# Altium project dashcam_bb_v2.0.PrjPcb (part 1 of 8)
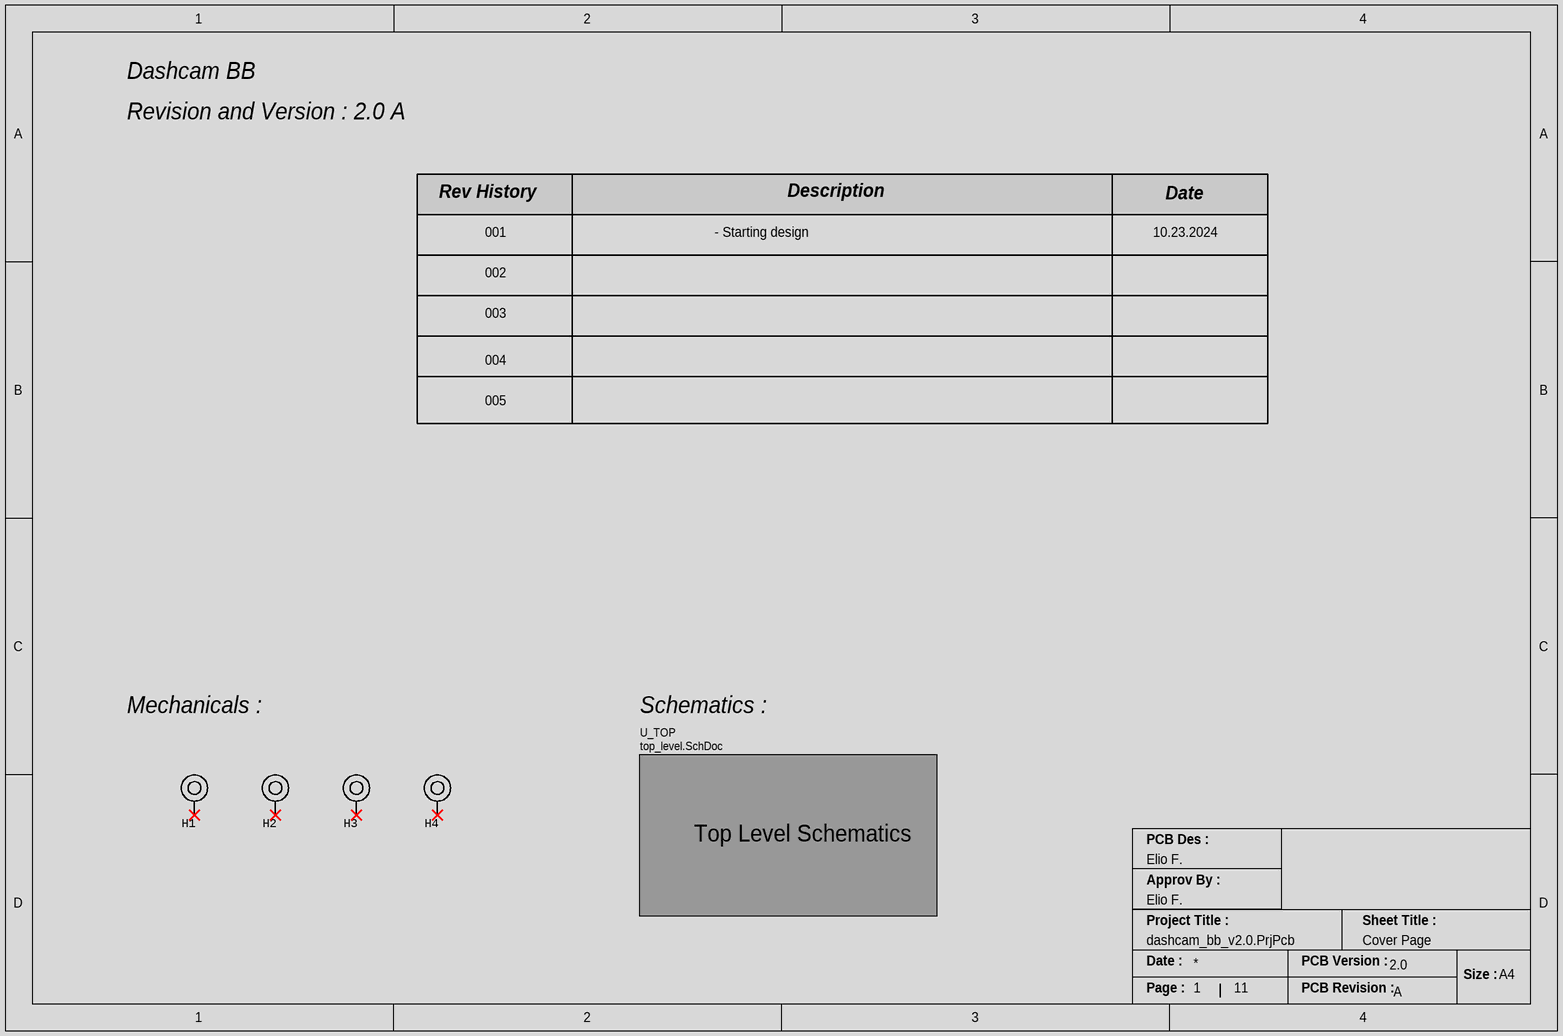
[diagram p0: cover_page.SchDoc]
Letter: A; ProjectTitle: Dashcam BB V2.0 A; Version: 2.0
11 sheets, 284 parts. Net scope: flat (ports and power ports of the same name join across sheets).
Board file: Dashcam BB V2.0 A.PcbDoc
Sheets:
  cover_page.SchDoc
    U_TOP = top_level.SchDoc
      U_CONNB = connector_b.SchDoc
      U_CONNA = connector_a.SchDoc
      U_GNSS_GPS = gnss_gps.SchDoc
      U_IMU = imu.SchDoc
      U_MIPI_SER1 = mipi_serializer1.SchDoc
      U_CAM_CONN = camera_connector.SchDoc
      U_MIPI_SER2 = mipi_serializer2.SchDoc
      U_MIPI_DES = mipi_deserializer.SchDoc
      U_MIPI_DES_POC = mipi_deserializer_poc.SchDoc

## Sheet cover_page.SchDoc
size A4; Email: eliofagundez07@gmail.com; DrawnBy: Elio F.; Engineer: Elio F.; Revision: A; SheetNumber: 1; SheetTotal: 11; Sheet Title: Cover Page

### Parts
H1  Mounting Hole  [PTH_3.2X5]  (value not drawn)  (no BOM)
H2  Mounting Hole  [PTH_3.2X5]  (value not drawn)  (no BOM)
H3  Mounting Hole  [PTH_3.2X5]  (value not drawn)  (no BOM)
H4  Mounting Hole  [PTH_3.2X5]  (value not drawn)  (no BOM)

### Sub-sheets
U_TOP = top_level.SchDoc: no entries

### Nets

Not connected (* = marked no-connect by the designer): H1 1*; H2 1*; H3 1*; H4 1*

### Notes on the sheet
- Dashcam BB
- Revision and Version : 2.0 A
- Rev History
- 001
- - Starting design
- Description
- 10.23.2024
- Date
- 002
- 003
- 004
- 005
- Mechanicals :
- Schematics :
- Top Level Schematics
- PCB Des :
- Approv By :
- Project Title :
- Sheet Title :
- Date :
- PCB Version :
- Size :
- A4
- Page :
- PCB Revision :

### Library data of the parts
H1-H4 = MECHANICALS_MOUNT_PTH: Mounting Hole, Plated

## Sheet top_level.SchDoc: top level
size A3; DrawnBy: Elio F; Engineer: Elio F; Revision: 1.0; SheetNumber: 2; SheetTotal: 11; Sheet Title: Top Level
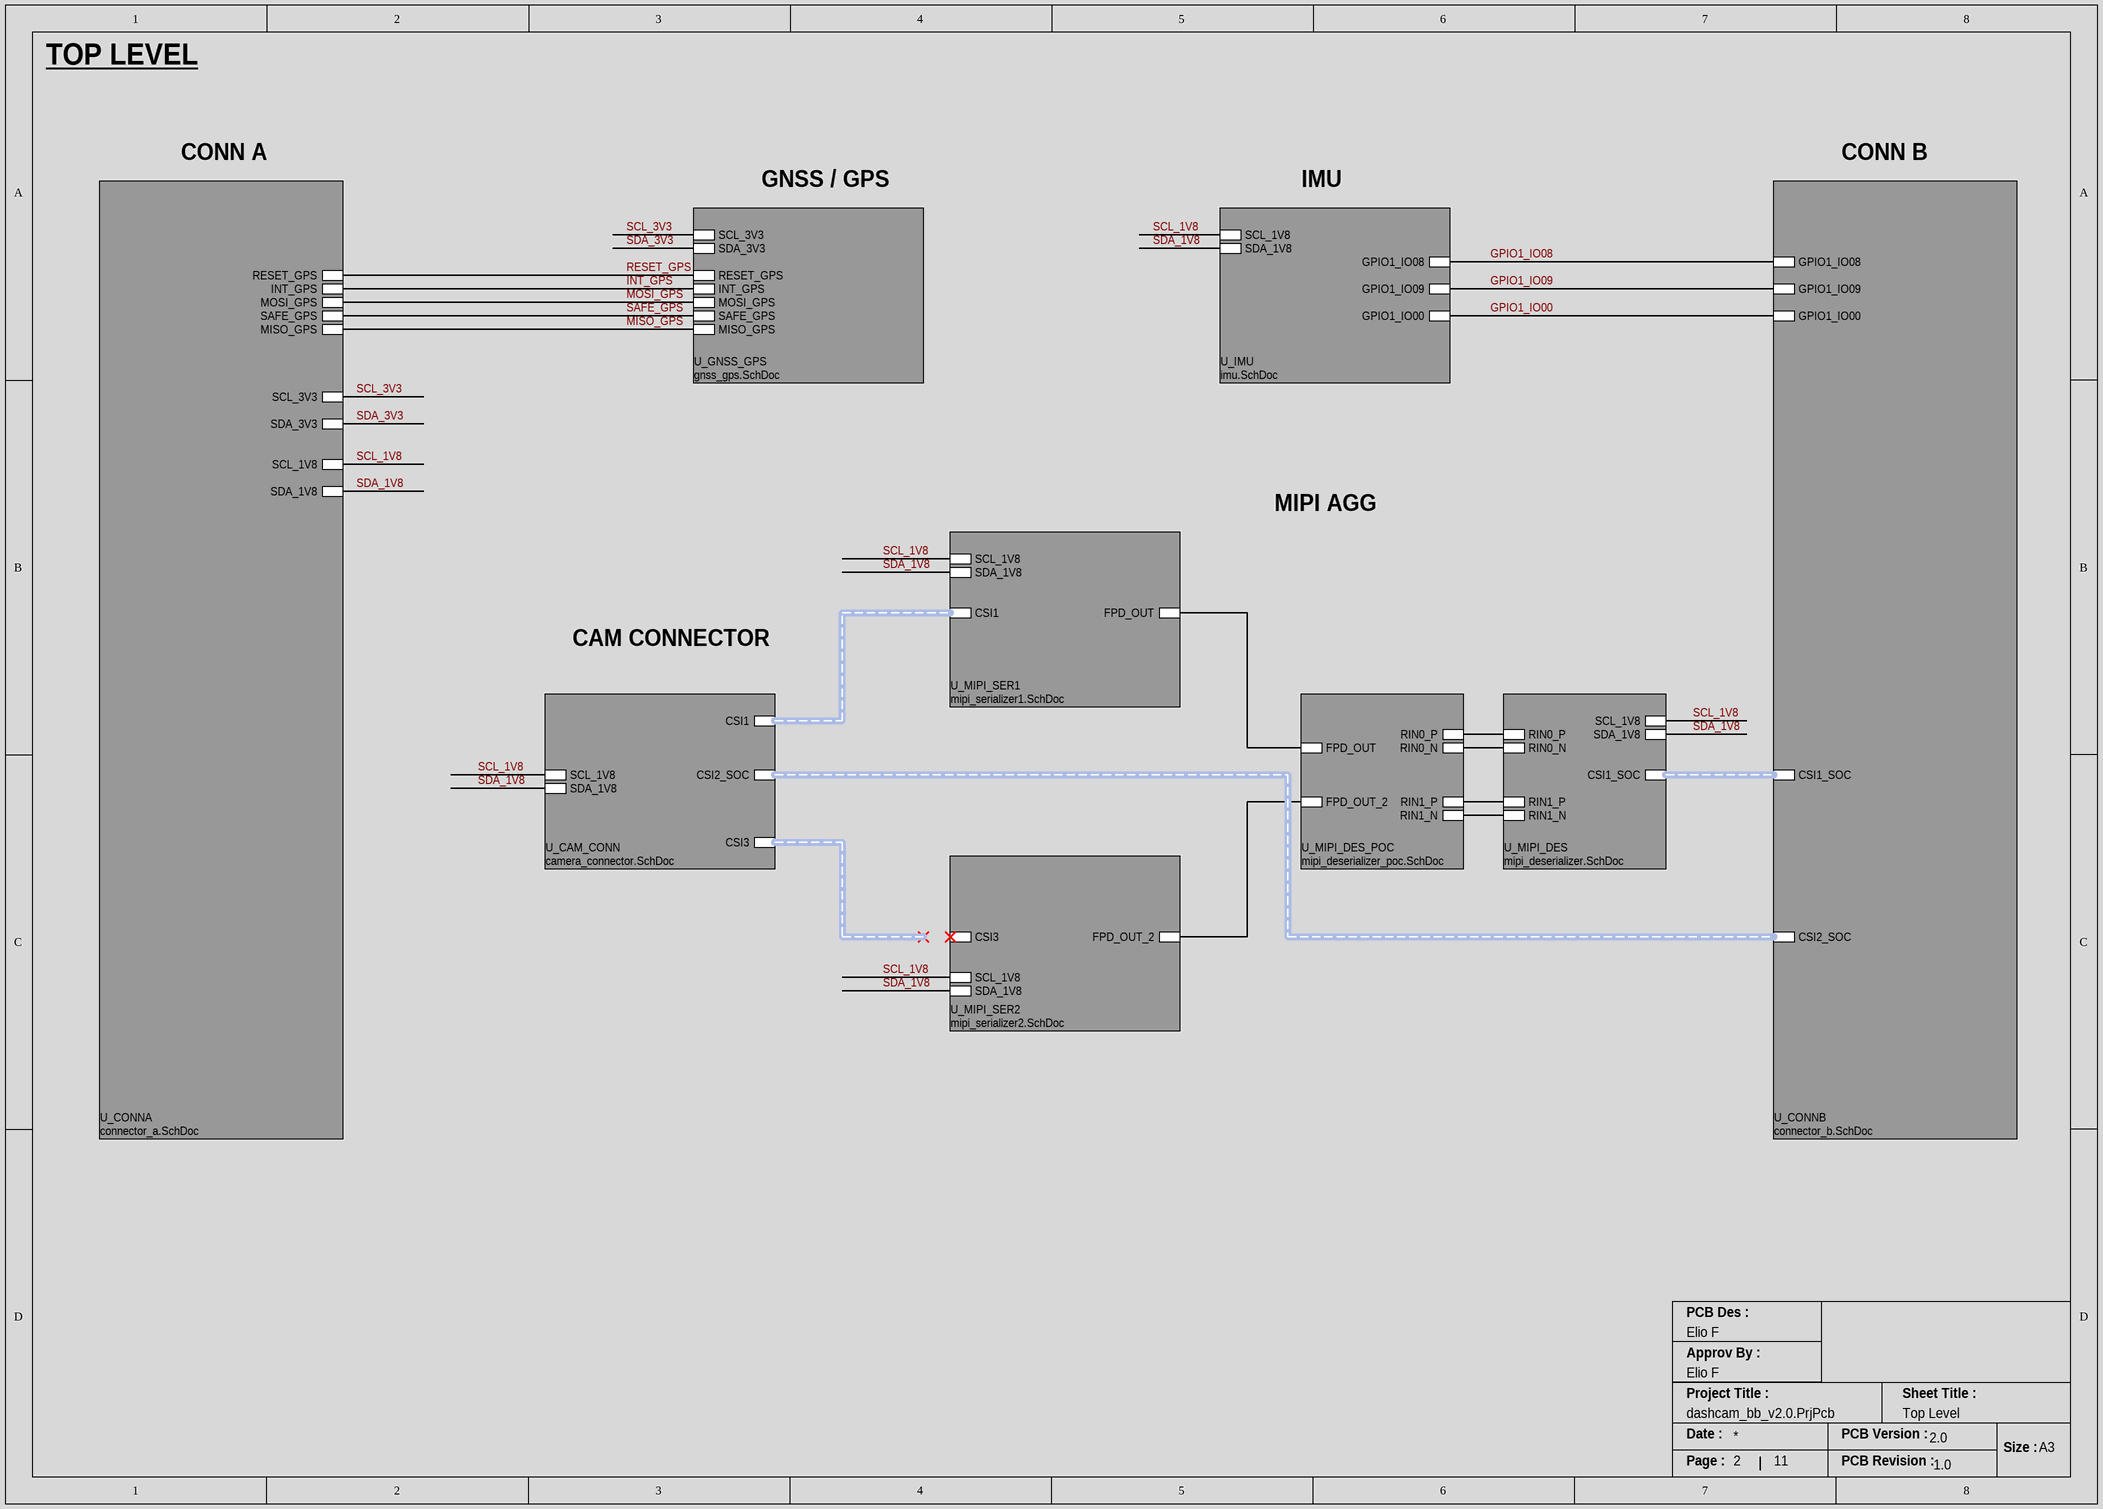
[diagram p1: top_level.SchDoc]

### Sub-sheets
U_CAM_CONN = camera_connector.SchDoc: CSI1 (harness CSI1), CSI3 (harness CSI3), CSI2_SOC (harness CSI2_SOC), SCL_1V8, SDA_1V8
U_CONNA = connector_a.SchDoc: SCL_3V3, SDA_3V3, RESET_GPS, INT_GPS, MOSI_GPS, SAFE_GPS, MISO_GPS, SCL_1V8, SDA_1V8
U_CONNB = connector_b.SchDoc: CSI2_SOC (harness CSI2_SOC), CSI1_SOC (harness CSI1_SOC), GPIO1_IO08, GPIO1_IO09, GPIO1_IO00
U_GNSS_GPS = gnss_gps.SchDoc: RESET_GPS, INT_GPS, MISO_GPS, MOSI_GPS, SAFE_GPS, SCL_3V3, SDA_3V3
U_IMU = imu.SchDoc: GPIO1_IO08, GPIO1_IO09, GPIO1_IO00, SCL_1V8, SDA_1V8
U_MIPI_DES = mipi_deserializer.SchDoc: RIN0_P, RIN0_N, RIN1_P, RIN1_N, CSI1_SOC (harness CSI1_SOC), SCL_1V8, SDA_1V8
U_MIPI_DES_POC = mipi_deserializer_poc.SchDoc: FPD_OUT, FPD_OUT_2, RIN0_P, RIN0_N, RIN1_P, RIN1_N
U_MIPI_SER1 = mipi_serializer1.SchDoc: CSI1 (harness CSI1), FPD_OUT, SCL_1V8, SDA_1V8
U_MIPI_SER2 = mipi_serializer2.SchDoc: CSI3 (harness CSI3), FPD_OUT_2, SCL_1V8, SDA_1V8

### Nets
GPIO1_IO00: sheet U_CONNB/GPIO1_IO00, sheet U_IMU/GPIO1_IO00
GPIO1_IO08: sheet U_CONNB/GPIO1_IO08, sheet U_IMU/GPIO1_IO08
GPIO1_IO09: sheet U_CONNB/GPIO1_IO09, sheet U_IMU/GPIO1_IO09
INT_GPS: sheet U_CONNA/INT_GPS, sheet U_GNSS_GPS/INT_GPS
MISO_GPS: sheet U_CONNA/MISO_GPS, sheet U_GNSS_GPS/MISO_GPS
MOSI_GPS: sheet U_CONNA/MOSI_GPS, sheet U_GNSS_GPS/MOSI_GPS
RESET_GPS: sheet U_CONNA/RESET_GPS, sheet U_GNSS_GPS/RESET_GPS
SAFE_GPS: sheet U_CONNA/SAFE_GPS, sheet U_GNSS_GPS/SAFE_GPS
SCL_1V8: sheet U_CONNA/SCL_1V8, sheet U_IMU/SCL_1V8, sheet U_MIPI_SER1/SCL_1V8, sheet U_CAM_CONN/SCL_1V8, sheet U_MIPI_SER2/SCL_1V8, sheet U_MIPI_DES/SCL_1V8
SCL_3V3: sheet U_CONNA/SCL_3V3, sheet U_GNSS_GPS/SCL_3V3
SDA_1V8: sheet U_CONNA/SDA_1V8, sheet U_IMU/SDA_1V8, sheet U_MIPI_SER1/SDA_1V8, sheet U_CAM_CONN/SDA_1V8, sheet U_MIPI_SER2/SDA_1V8, sheet U_MIPI_DES/SDA_1V8
SDA_3V3: sheet U_CONNA/SDA_3V3, sheet U_GNSS_GPS/SDA_3V3
(unnamed): sheet U_MIPI_SER1/FPD_OUT, sheet U_MIPI_DES_POC/FPD_OUT
(unnamed): sheet U_MIPI_SER2/FPD_OUT_2, sheet U_MIPI_DES_POC/FPD_OUT_2
(unnamed): sheet U_MIPI_DES/RIN0_P, sheet U_MIPI_DES_POC/RIN0_P
(unnamed): sheet U_MIPI_DES/RIN0_N, sheet U_MIPI_DES_POC/RIN0_N
(unnamed): sheet U_MIPI_DES/RIN1_P, sheet U_MIPI_DES_POC/RIN1_P
(unnamed): sheet U_MIPI_DES/RIN1_N, sheet U_MIPI_DES_POC/RIN1_N

### Buses and harness runs
harness sheet U_CAM_CONN/CSI1 = sheet U_MIPI_SER1/CSI1
harness sheet U_CAM_CONN/CSI2_SOC = sheet U_CONNB/CSI2_SOC
harness sheet U_CONNB/CSI1_SOC = sheet U_MIPI_DES/CSI1_SOC

### Notes on the sheet
- TOP LEVEL
- CONN A
- CONN B
- GNSS / GPS
- IMU
- MIPI AGG
- CAM CONNECTOR
- PCB Des :
- Approv By :
- Project Title :
- Sheet Title :
- Date :
- PCB Version :
- Size :
- A3
- Page :
- PCB Revision :

## Sheet connector_b.SchDoc
size A3; DrawnBy: Elio F; Engineer: Elio F; Revision: A; SheetNumber: 4; SheetTotal: 11; Sheet Title: Connector B
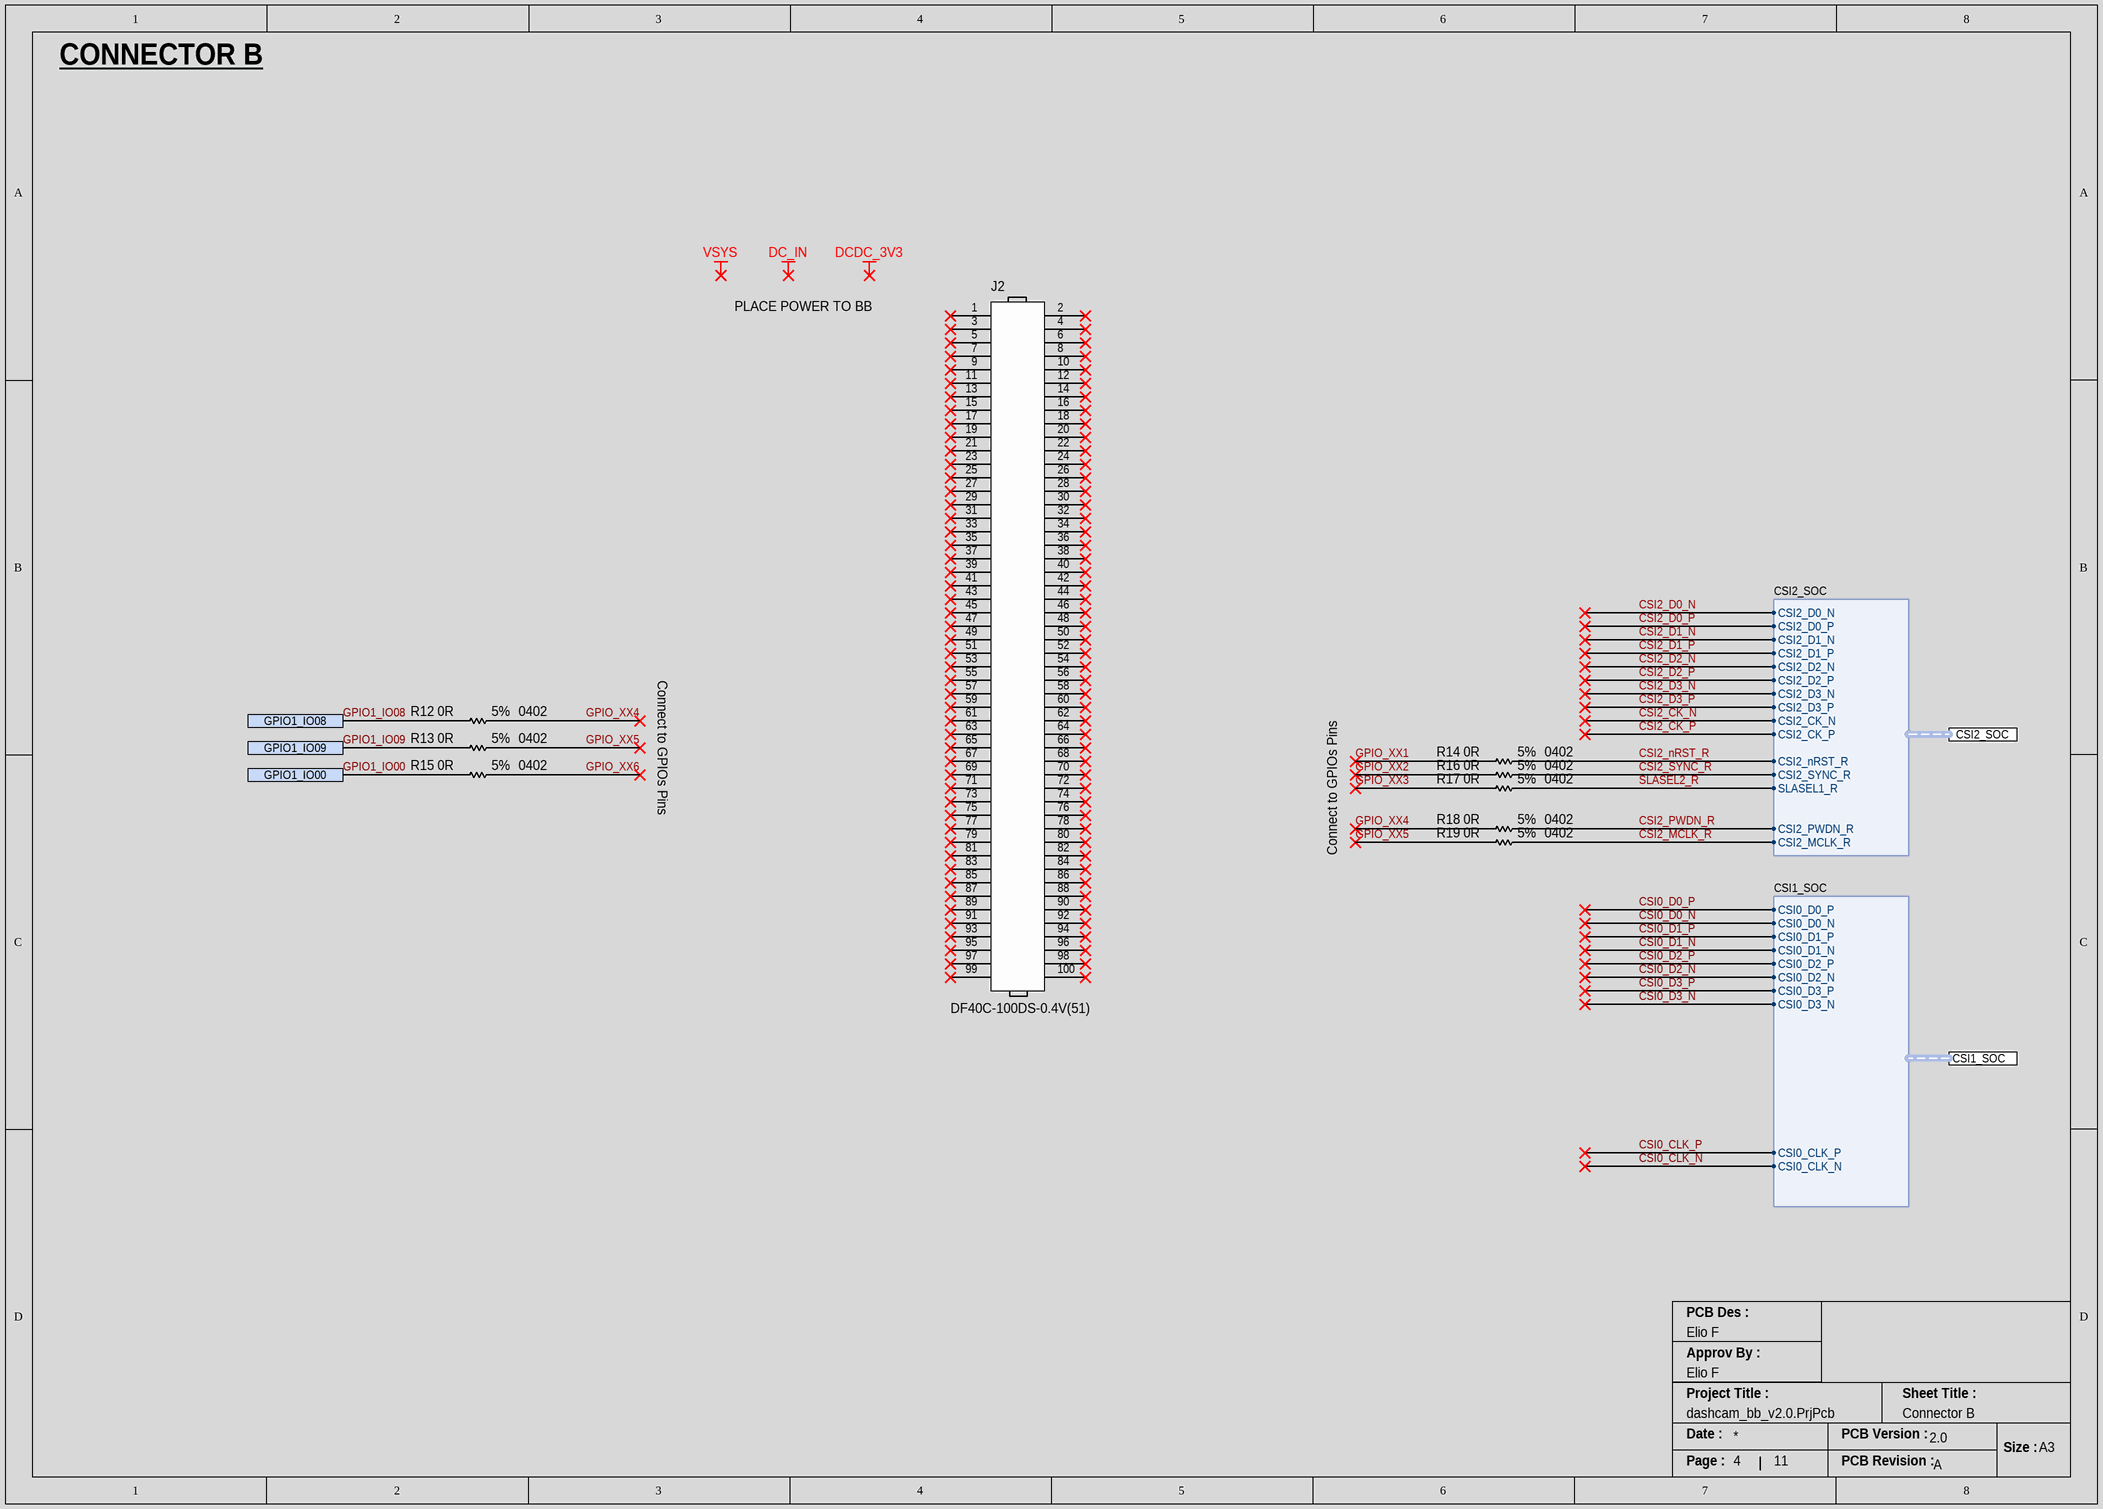
[diagram p2: connector_b.SchDoc]

### Parts
J2  DF40C-100DS-0.4V(51)  [CONN_B2B_HIROSE_DF40C-100DS-0.4V(51)]
R12  Case Code (Imperial): 0402  Tolerance: 5%  Resistance: 0R  [RES_0402_RESC1005X04N]  (hidden comment: ERJ-2GE0R00X)
R13  Case Code (Imperial): 0402  Tolerance: 5%  Resistance: 0R  [RES_0402_RESC1005X04N]  (hidden comment: ERJ-2GE0R00X)
R14  Case Code (Imperial): 0402  Tolerance: 5%  Resistance: 0R  [RES_0402_RESC1005X04N]  (hidden comment: ERJ-2GE0R00X)
R15  Case Code (Imperial): 0402  Tolerance: 5%  Resistance: 0R  [RES_0402_RESC1005X04N]  (hidden comment: ERJ-2GE0R00X)
R16  Case Code (Imperial): 0402  Tolerance: 5%  Resistance: 0R  [RES_0402_RESC1005X04N]  (hidden comment: ERJ-2GE0R00X)
R17  Case Code (Imperial): 0402  Tolerance: 5%  Resistance: 0R  [RES_0402_RESC1005X04N]  (hidden comment: ERJ-2GE0R00X)
R18  Case Code (Imperial): 0402  Tolerance: 5%  Resistance: 0R  [RES_0402_RESC1005X04N]  (hidden comment: ERJ-2GE0R00X)
R19  Case Code (Imperial): 0402  Tolerance: 5%  Resistance: 0R  [RES_0402_RESC1005X04N]  (hidden comment: ERJ-2GE0R00X)

### Ports
CSI1_SOC (harness CSI1_SOC), CSI2_SOC (harness CSI2_SOC), GPIO1_IO00, GPIO1_IO08, GPIO1_IO09

### Harnesses
CSI2_SOC: CSI2_D0_N, CSI2_D0_P, CSI2_D1_N, CSI2_D1_P, CSI2_D2_N, CSI2_D2_P, CSI2_D3_N, CSI2_D3_P, CSI2_CK_N, CSI2_CK_P, CSI2_nRST_R, CSI2_SYNC_R, SLASEL1_R, CSI2_PWDN_R, CSI2_MCLK_R
CSI1_SOC: CSI0_D0_P, CSI0_D0_N, CSI0_D1_P, CSI0_D1_N, CSI0_D2_P, CSI0_D2_N, CSI0_D3_P, CSI0_D3_N, CSI0_CLK_P, CSI0_CLK_N

### Nets
CSI2_MCLK_R: R19.2 ; port CSI2_SOC.CSI2_MCLK_R
CSI2_nRST_R: R14.2 ; port CSI2_SOC.CSI2_nRST_R
CSI2_PWDN_R: R18.2 ; port CSI2_SOC.CSI2_PWDN_R
CSI2_SYNC_R: R16.2 ; port CSI2_SOC.CSI2_SYNC_R
GPIO1_IO00: R15.1 ; port GPIO1_IO00
GPIO1_IO08: R12.1 ; port GPIO1_IO08
GPIO1_IO09: R13.1 ; port GPIO1_IO09
GPIO_XX1: R14.1
GPIO_XX2: R16.1
GPIO_XX3: R17.1
GPIO_XX4: R12.2 R18.1
GPIO_XX5: R13.2 R19.1
GPIO_XX6: R15.2
SLASEL2_R: R17.2 ; port CSI2_SOC.SLASEL1_R

Not connected (* = marked no-connect by the designer): J2 1* 2* 3* 4* 5* 6* 7* 8* 9* 10* 11* 12* 13* 14* 15* 16* 17* 18* 19* 20* 21* 22* 23* 24* 25* 26* 27* 28* 29* 30* 31* 32* 33* 34* 35* 36* 37* 38* 39* 40* 41* 42* 43* 44* 45* 46* 47* 48* 49* 50* 51* 52* 53* 54* 55* 56* 57* 58* 59* 60* 61* 62* 63* 64* 65* 66* 67* 68* 69* 70* 71* 72* 73* 74* 75* 76* 77* 78* 79* 80* 81* 82* 83* 84* 85* 86* 87* 88* 89* 90* 91* 92* 93* 94* 95* 96* 97* 98* 99* 100*

### Notes on the sheet
- CONNECTOR B
- PLACE POWER TO BB
- Connect to GPIOs Pins
- Labels drawn without touching a wire or pin: DC_IN, DCDC_3V3, VSYS
- PCB Des :
- Approv By :
- Project Title :
- Sheet Title :
- Date :
- PCB Version :
- Size :
- A3
- Page :
- PCB Revision :

### Library data of the parts
J2 = CONN_B2B_100P_RE_DF40C-100DS-0.4V(51): Board-to-Board Connector with 0.4-mm Pitch, 1.5 - 4.0-mm Height - DF40 Series (HIROSE ELECTRIC); Voltage Rating: 30V; Current Rating: 300mA; Connector Type: Receptacle; Number of Positions: 100; Contact Resistance: 90mR; Pitch: 0.4mm; Mated Stacking Heights: 1.5mm; Contact Pitch: 400um; Supplier 1: Digikey; Manufacturer: Hirose; Manufacturer Part Number: DF40C-100DS-0.4V(51); RoHS: Yes; Category: Headers and Wire Housings; Stock 1: 4275; Pricing 1: 1=1.91, 10=1.661, 25=1.5908, 50=1.5554, 100=1.4847, 250=1.34328, 500=1.23724, 1000=1.0605, 2500=0.9898 (USD); Mount: Surface Mount; Contact Material: Bronze; Contact Plating: Gold; Housing Material: Polymer; Housing Color: Black; Min Operating Temperature: -35°C; Max Operating Temperature: 85°C; Number of Rows: 2; Packaging: Tape and Reel; Package Quantity: 1; Termination: SMD/SMT; Number of Contacts: 100; Orientation: Straight; Series: DF40; Max Current Rating: 300mA; Max Voltage Rating (AC): 30V; Gender: Receptacle; Contact Voltage Rating (AC): 30V; Contact Voltage Rating (DC): 30V; Length: 22.6mm; Depth: 3.38mm; Radiation Hardening: No; Reach SVHC Compliant: No; Lead Free: Lead Free; RoHS Compliant: Yes; ComponentLink1URL: https://datasheet.ciiva.com/26948/getdatasheetpartid-441624-26948933.pdf?src-supplier=Verical; ComponentLink1Description: https://datasheet.ciiva.com/26948/getdatasheetpartid-441624-26948933.pdf?src-supplier=Verical; ComponentLink2URL: https://datasheet.ciiva.com/46408/1824826-46408894.pdf?src-supplier=Element14; ComponentLink2Description: https://datasheet.ciiva.com/46408/1824826-46408894.pdf?src-supplier=Element14; Supplier Part Number 1: H11615CT-ND
R12-R19 = RES_0R_5%_100mW_0402: SMD Chip Resistor, Jumper, 0 ohm, 100 mW, 0402 [1005 Metric], Thick Film, General Purpose; Manufacturer: Panasonic; Power Rating: 100mW; Voltage Rating: 50V; Temperature Coefficient: 600ppm/°C; Supplier 1: Mouser; Manufacturer Part Number: ERJ-2GE0R00X; RoHS: Yes; Category: Chip SMD Resistors; Stock 1: 10989354; Pricing 1: 1=0.1, 10=0.013, 50=0.013, 100=0.006, 1000=0.004, 2500=0.003, 10000=0.003 (USD); Mount: Surface Mount; Case/Package: 0402; Contact Plating: Tin; Case Code (Metric): 1005; Size Code: 0402; Min Operating Temperature: -55°C; Max Operating Temperature: 155°C; Resistor Type: Thick Film; Packaging: Cut Tape; Package Quantity: 10000; Number of Terminations: 2; Termination: SMD/SMT; Max Power Dissipation: 100mW; Voltage Rating (DC): 50V; Features: Automotive AEC-Q200; Series: ERJ; Construction: Rectangular; Technology: THICK FILM; Length: 1mm; Width: 0.5mm; Height: 0.35mm; Depth: 0.5mm; Ratings: AEC-Q200; Radiation Hardening: No; Reach SVHC Compliant: No; Military Standard: Not; Lead Free: Lead Free; RoHS Compliant: Yes; ComponentLink1URL: https://datasheet.ciiva.com/11821/0900766b80f806dd-11821176.pdf?src-supplier=Rs; ComponentLink1Description: https://datasheet.ciiva.com/11821/0900766b80f806dd-11821176.pdf?src-supplier=Rs; ComponentLink2URL: https://datasheet.ciiva.com/43460/1678796-43460347.pdf?src-supplier=Farnell; ComponentLink2Description: https://datasheet.ciiva.com/43460/1678796-43460347.pdf?src-supplier=Farnell; ComponentLink3URL: https://datasheet.ciiva.com/46389/1678796-46389518.pdf?src-supplier=Element14; ComponentLink3Description: https://datasheet.ciiva.com/46389/1678796-46389518.pdf?src-supplier=Element14; ComponentLink4URL: https://datasheet.ciiva.com/5959/1678796-5959692.pdf?src-supplier=Farnell; ComponentLink4Description: https://datasheet.ciiva.com/5959/1678796-5959692.pdf?src-supplier=Farnell; ComponentLink5URL: https://datasheet.ciiva.com/28695/1678796-28695758.pdf?src-supplier=Element14; ComponentLink5Description: https://datasheet.ciiva.com/28695/1678796-28695758.pdf?src-supplier=Element14; ComponentLink6URL: https://datasheet.ciiva.com/16783/70260739-16783734.pdf?src-supplier=Allied+Electronics; ComponentLink6Description: https://datasheet.ciiva.com/16783/70260739-16783734.pdf?src-supplier=Allied+Electronics; ComponentLink7URL: https://datasheet.ciiva.com/16778/70260739-16778335.pdf?src-supplier=Allied+Electronics; ComponentLink7Description: https://datasheet.ciiva.com/16778/70260739-16778335.pdf?src-supplier=Allied+Electronics; ComponentLink8URL: https://datasheet.ciiva.com/48531/aoa0000ce1-48531077.pdf?src-supplier=Avnet; ComponentLink8Description: https://datasheet.ciiva.com/48531/aoa0000ce1-48531077.pdf?src-supplier=Avnet; ComponentLink9URL: https://datasheet.ciiva.com/30097/4aoa0000ce1-30097116.pdf?src-supplier=Onlinecomponents.com; ComponentLink9Description: https://datasheet.ciiva.com/30097/4aoa0000ce1-30097116.pdf?src-supplier=Onlinecomponents.com; Supplier Part Number 1: 667-ERJ-2GE0R00X

## Sheet connector_a.SchDoc
size A3; DrawnBy: Elio F; Engineer: Elio F; Revision: A; SheetNumber: 3; SheetTotal: 11; Sheet Title: Connector A
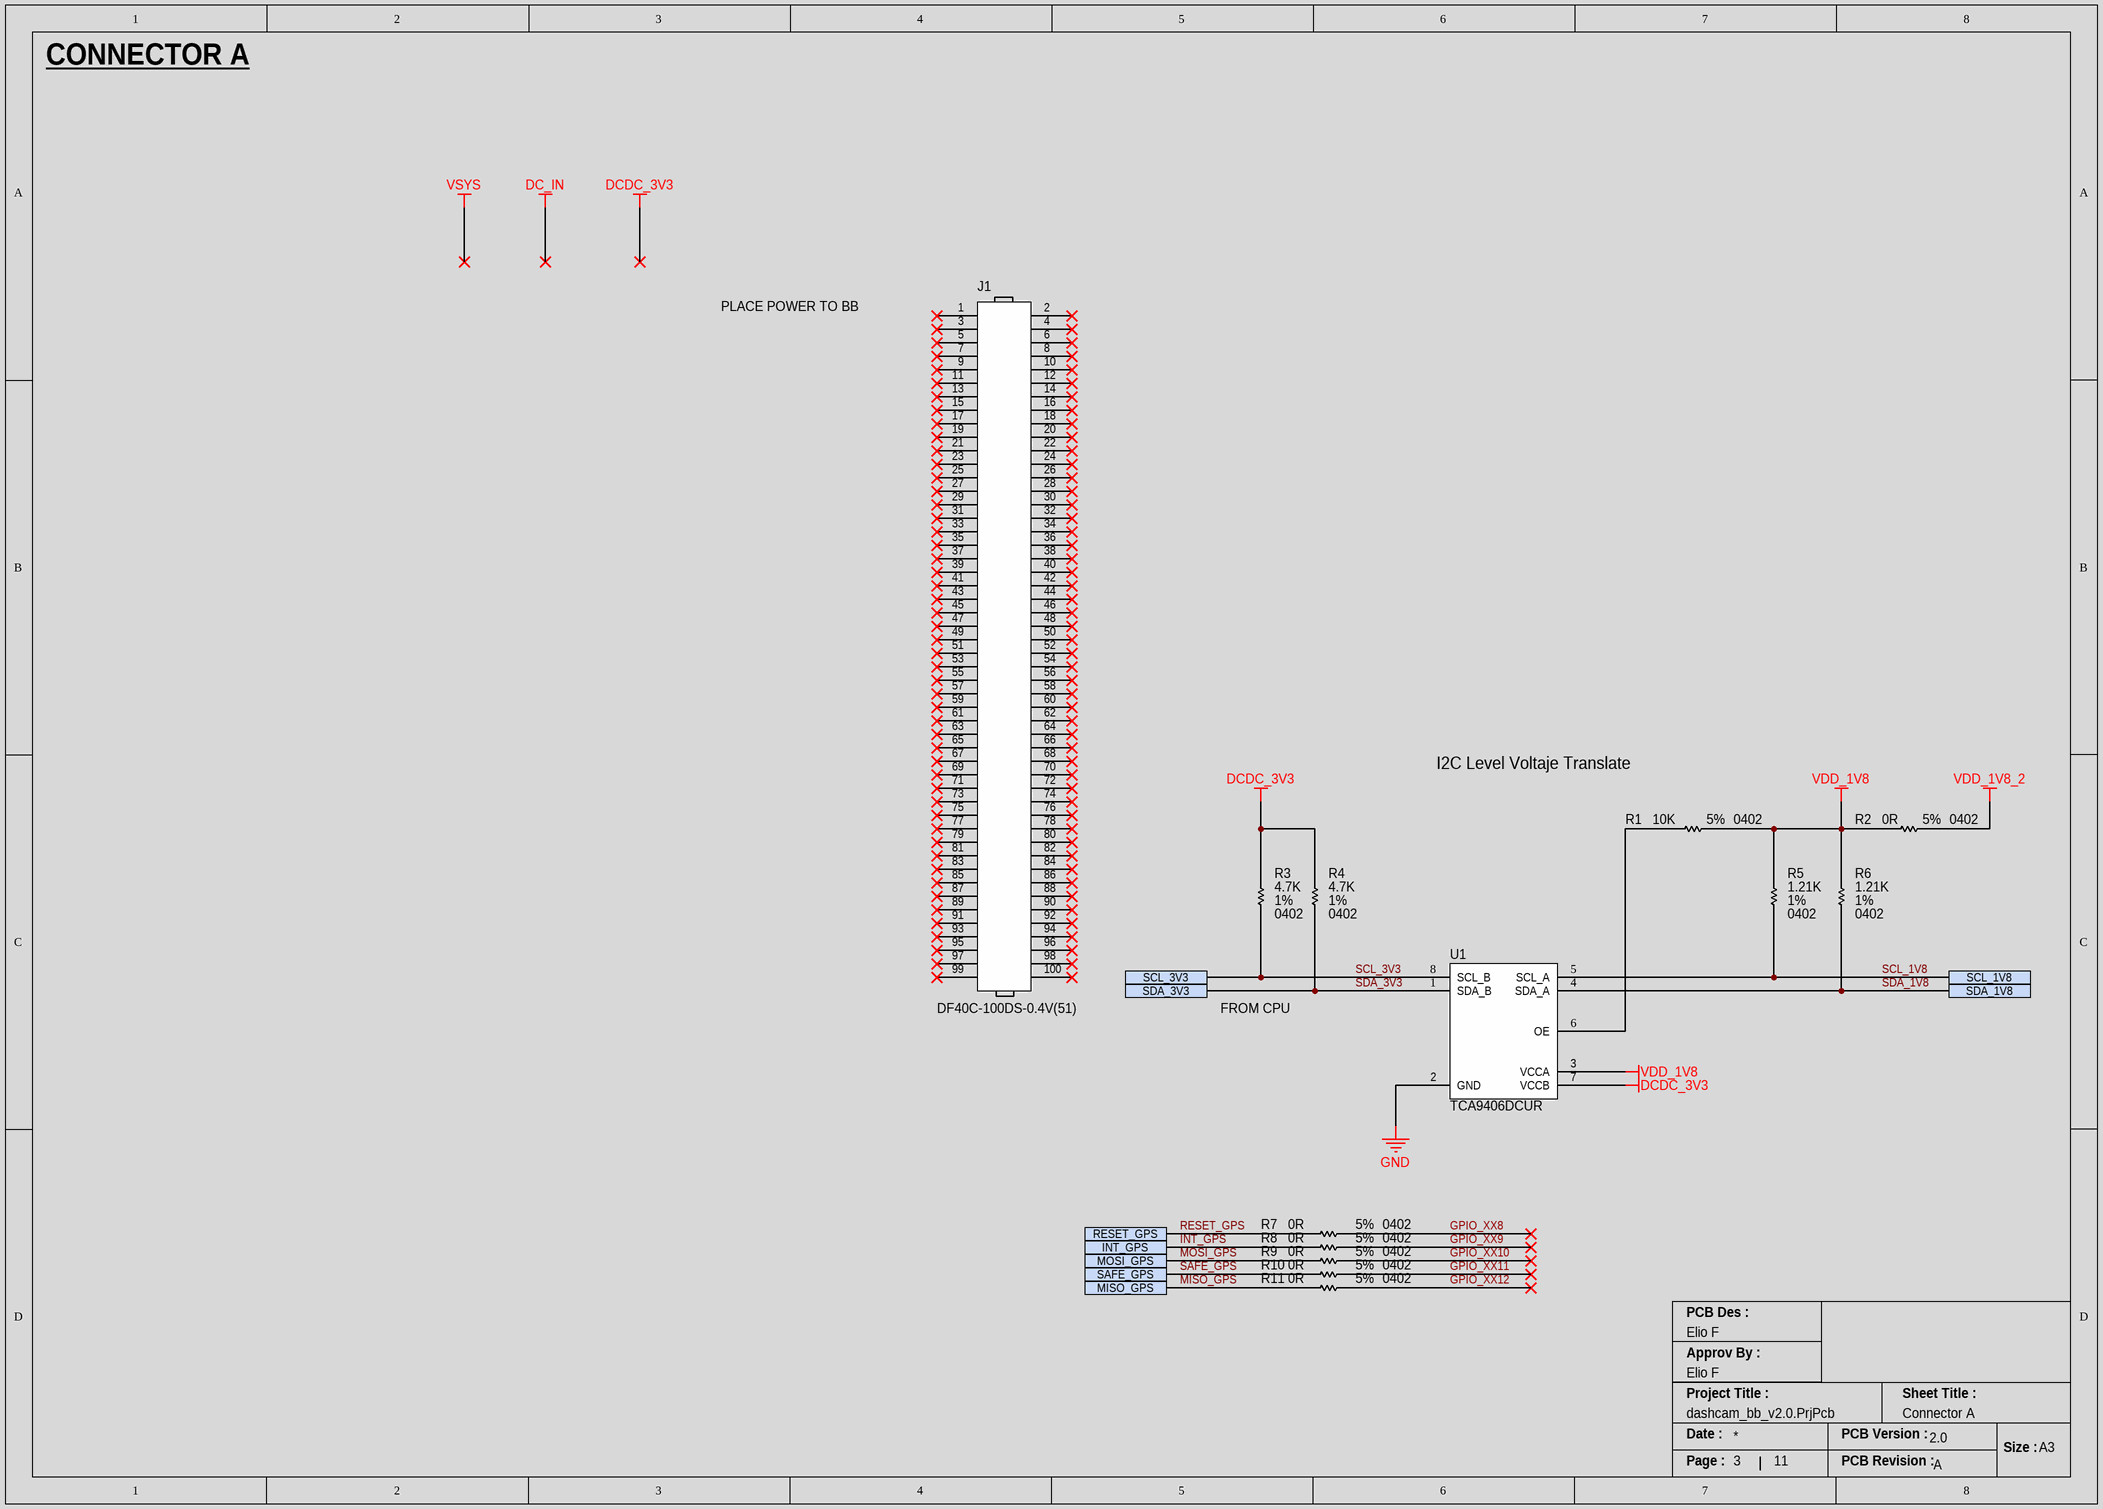
[diagram p3: connector_a.SchDoc]

### Parts
J1  DF40C-100DS-0.4V(51)  [CONN_B2B_HIROSE_DF40C-100DS-0.4V(51)]
R1  Tolerance: 5%  Resistance: 10K  Case/Package: 0402  [RES_0402_RESC1005X04N]  (hidden comment: ERJ-2GEJ103X)
R2  Case Code (Imperial): 0402  Tolerance: 5%  Resistance: 0R  [RES_0402_RESC1005X04N]  (hidden comment: ERJ-2GE0R00X)
R3  Tolerance: 1%  Case Code (Imperial): 0402  Resistance: 4.7K  [RES_0402_RESC1005X04N]  (hidden comment: ERJ-2RKF4701X)
R4  Tolerance: 1%  Case Code (Imperial): 0402  Resistance: 4.7K  [RES_0402_RESC1005X04N]  (hidden comment: ERJ-2RKF4701X)
R5  Tolerance: 1%  Resistance: 1.21K  Case/Package: 0402  [RES_0402_RESC1005X04N]  (hidden comment: CRCW04021K21FKED)
R6  Tolerance: 1%  Resistance: 1.21K  Case/Package: 0402  [RES_0402_RESC1005X04N]  (hidden comment: CRCW04021K21FKED)
R7  Case Code (Imperial): 0402  Tolerance: 5%  Resistance: 0R  [RES_0402_RESC1005X04N]  (hidden comment: ERJ-2GE0R00X)
R8  Case Code (Imperial): 0402  Tolerance: 5%  Resistance: 0R  [RES_0402_RESC1005X04N]  (hidden comment: ERJ-2GE0R00X)
R9  Case Code (Imperial): 0402  Tolerance: 5%  Resistance: 0R  [RES_0402_RESC1005X04N]  (hidden comment: ERJ-2GE0R00X)
R10  Case Code (Imperial): 0402  Tolerance: 5%  Resistance: 0R  [RES_0402_RESC1005X04N]  (hidden comment: ERJ-2GE0R00X)
R11  Case Code (Imperial): 0402  Tolerance: 5%  Resistance: 0R  [RES_0402_RESC1005X04N]  (hidden comment: ERJ-2GE0R00X)
U1  TCA9406DCUR  [IC_LEVEL_TRASLATOR_SOP50P310X90-8N]

### Ports
INT_GPS, MISO_GPS, MOSI_GPS, RESET_GPS, SAFE_GPS, SCL_1V8, SCL_3V3, SDA_1V8, SDA_3V3

### Nets
DCDC_3V3: R3.1 R4.1 U1.7(VCCB)
GND: U1.2(GND)
VDD_1V8: R1.2 R2.1 R5.2 R6.2 U1.3(VCCA)
VDD_1V8_2: R2.2
GPIO_XX8: R7.2
GPIO_XX9: R8.2
GPIO_XX10: R9.2
GPIO_XX11: R10.2
GPIO_XX12: R11.2
INT_GPS: R8.1 ; port INT_GPS
MISO_GPS: R11.1 ; port MISO_GPS
MOSI_GPS: R9.1 ; port MOSI_GPS
RESET_GPS: R7.1 ; port RESET_GPS
SAFE_GPS: R10.1 ; port SAFE_GPS
SCL_1V8: R5.1 U1.5(SCL_A) ; port SCL_1V8
SCL_3V3: R3.2 U1.8(SCL_B) ; port SCL_3V3
SDA_1V8: R6.1 U1.4(SDA_A) ; port SDA_1V8
SDA_3V3: R4.2 U1.1(SDA_B) ; port SDA_3V3
NetR1_1: R1.1 U1.6(OE)

Not connected (* = marked no-connect by the designer): J1 1* 2* 3* 4* 5* 6* 7* 8* 9* 10* 11* 12* 13* 14* 15* 16* 17* 18* 19* 20* 21* 22* 23* 24* 25* 26* 27* 28* 29* 30* 31* 32* 33* 34* 35* 36* 37* 38* 39* 40* 41* 42* 43* 44* 45* 46* 47* 48* 49* 50* 51* 52* 53* 54* 55* 56* 57* 58* 59* 60* 61* 62* 63* 64* 65* 66* 67* 68* 69* 70* 71* 72* 73* 74* 75* 76* 77* 78* 79* 80* 81* 82* 83* 84* 85* 86* 87* 88* 89* 90* 91* 92* 93* 94* 95* 96* 97* 98* 99* 100*

### Notes on the sheet
- CONNECTOR A
- PLACE POWER TO BB
- I2C Level Voltaje Translate
- FROM CPU
- PCB Des :
- Approv By :
- Project Title :
- Sheet Title :
- Date :
- PCB Version :
- Size :
- A3
- Page :
- PCB Revision :

### Library data of the parts
J1 = CONN_B2B_100P_RE_DF40C-100DS-0.4V(51): as J2 on sheet connector_b; Supplier 1: Digikey; Manufacturer: Hirose; Manufacturer Part Number: DF40C-100DS-0.4V(51); RoHS: Yes; Category: Headers and Wire Housings; Stock 1: 4275; Pricing 1: 1=1.91, 10=1.661, 25=1.5908, 50=1.5554, 100=1.4847, 250=1.34328, 500=1.23724, 1000=1.0605, 2500=0.9898 (USD); Mount: Surface Mount; Contact Material: Bronze; Contact Plating: Gold; Housing Material: Polymer; Housing Color: Black; Min Operating Temperature: -35°C; Max Operating Temperature: 85°C; Number of Rows: 2; Packaging: Tape and Reel; Package Quantity: 1; Termination: SMD/SMT; Number of Contacts: 100; Orientation: Straight; Series: DF40; Max Current Rating: 300mA; Max Voltage Rating (AC): 30V; Gender: Receptacle; Contact Voltage Rating (AC): 30V; Contact Voltage Rating (DC): 30V; Length: 22.6mm; Depth: 3.38mm; Radiation Hardening: No; Reach SVHC Compliant: No; Lead Free: Lead Free; RoHS Compliant: Yes; ComponentLink1URL: https://datasheet.ciiva.com/26948/getdatasheetpartid-441624-26948933.pdf?src-supplier=Verical; ComponentLink1Description: https://datasheet.ciiva.com/26948/getdatasheetpartid-441624-26948933.pdf?src-supplier=Verical; ComponentLink2URL: https://datasheet.ciiva.com/46408/1824826-46408894.pdf?src-supplier=Element14; ComponentLink2Description: https://datasheet.ciiva.com/46408/1824826-46408894.pdf?src-supplier=Element14; Supplier Part Number 1: H11615CT-ND
R1 = RES_10K_5%_100mW_0402: Res Thick Film 0402 10K Ohm 5% 1/10W ±200ppm/°C Molded SMD Punched Carrier T/R; Manufacturer: Panasonic; Power Rating: 100mW; Voltage Rating: 50V; Supplier 1: Digi-Key; Manufacturer Part Number: ERJ-2GEJ103X; RoHS: Yes; Category: Chip SMD Resistors; Stock 1: 4696986; Pricing 1: 1=0.1, 10=0.021, 50=0.0132, 100=0.011, 500=0.00744, 1000=0.00639, 5000=0.00464 (USD); Mount: Surface Mount; Contact Plating: Tin; Case Code (Metric): 1005; Case Code (Imperial): 0402; Size Code: 0402; Min Operating Temperature: -55°C; Max Operating Temperature: 155°C; Temperature Coefficient: 200ppm/°C; Packaging: Cut Tape; Resistor Type: Thick Film; Package Quantity: 10000; Number of Terminations: 2; Termination: SMD/SMT; Max Power Dissipation: 100mW; Features: Automotive AEC-Q200; Series: ERJ; Resistance Tolerance: 5%; Technology: THICK FILM; Voltage Rating (DC): 50V; Length: 1mm; Width: 0.5mm; Height: 0.35mm; Depth: 0.5mm; Ratings: AEC-Q200; Radiation Hardening: No; Reach SVHC Compliant: No; RoHS Compliant: Yes; Lead Free: 5697LeadFree; ComponentLink1URL: https://datasheet.ciiva.com/27055/1935721-27055112.pdf?src-supplier=Jameco; ComponentLink1Description: https://datasheet.ciiva.com/27055/1935721-27055112.pdf?src-supplier=Jameco; ComponentLink2URL: https://datasheet.ciiva.com/11821/0900766b80f806dd-11821170.pdf?src-supplier=Rs; ComponentLink2Description: https://datasheet.ciiva.com/11821/0900766b80f806dd-11821170.pdf?src-supplier=Rs; ComponentLink3URL: https://datasheet.ciiva.com/43460/1678796-43460391.pdf?src-supplier=Farnell; ComponentLink3Description: https://datasheet.ciiva.com/43460/1678796-43460391.pdf?src-supplier=Farnell; ComponentLink4URL: https://datasheet.ciiva.com/22785/1678796-22785949.pdf?src-supplier=Farnell; ComponentLink4Description: https://datasheet.ciiva.com/22785/1678796-22785949.pdf?src-supplier=Farnell; ComponentLink5URL: https://datasheet.ciiva.com/46371/1678796-46371910.pdf?src-supplier=Element14; ComponentLink5Description: https://datasheet.ciiva.com/46371/1678796-46371910.pdf?src-supplier=Element14; ComponentLink6URL: https://datasheet.ciiva.com/28514/1678796-28514154.pdf?src-supplier=Element14; ComponentLink6Description: https://datasheet.ciiva.com/28514/1678796-28514154.pdf?src-supplier=Element14; ComponentLink7URL: https://datasheet.ciiva.com/24070/aoa0000ce1-37422-24070679.pdf?src-supplier=Mouser; ComponentLink7Description: https://datasheet.ciiva.com/24070/aoa0000ce1-37422-24070679.pdf?src-supplier=Mouser; ComponentLink8URL: https://datasheet.ciiva.com/16767/70260739-16767130.pdf?src-supplier=Allied+Electronics; ComponentLink8Description: https://datasheet.ciiva.com/16767/70260739-16767130.pdf?src-supplier=Allied+Electronics; ComponentLink9URL: https://datasheet.ciiva.com/16774/70260739-16774504.pdf?src-supplier=Allied+Electronics; ComponentLink9Description: https://datasheet.ciiva.com/16774/70260739-16774504.pdf?src-supplier=Allied+Electronics; ComponentLink10URL: https://datasheet.ciiva.com/9194/aoa0000ce1-9194140.pdf?src-supplier=Avnet; ComponentLink10Description: https://datasheet.ciiva.com/9194/aoa0000ce1-9194140.pdf?src-supplier=Avnet; Supplier Part Number 1: P10KJCT-ND
R2 R7-R11 = RES_0R_5%_100mW_0402: as R12 on sheet connector_b; Supplier 1: Mouser; Manufacturer Part Number: ERJ-2GE0R00X; RoHS: Yes; Category: Chip SMD Resistors; Stock 1: 10989354; Pricing 1: 1=0.1, 10=0.013, 50=0.013, 100=0.006, 1000=0.004, 2500=0.003, 10000=0.003 (USD); Mount: Surface Mount; Case/Package: 0402; Contact Plating: Tin; Case Code (Metric): 1005; Size Code: 0402; Min Operating Temperature: -55°C; Max Operating Temperature: 155°C; Resistor Type: Thick Film; Packaging: Cut Tape; Package Quantity: 10000; Number of Terminations: 2; Termination: SMD/SMT; Max Power Dissipation: 100mW; Voltage Rating (DC): 50V; Features: Automotive AEC-Q200; Series: ERJ; Construction: Rectangular; Technology: THICK FILM; Length: 1mm; Width: 0.5mm; Height: 0.35mm; Depth: 0.5mm; Ratings: AEC-Q200; Radiation Hardening: No; Reach SVHC Compliant: No; Military Standard: Not; Lead Free: Lead Free; RoHS Compliant: Yes; ComponentLink1URL: https://datasheet.ciiva.com/11821/0900766b80f806dd-11821176.pdf?src-supplier=Rs; ComponentLink1Description: https://datasheet.ciiva.com/11821/0900766b80f806dd-11821176.pdf?src-supplier=Rs; ComponentLink2URL: https://datasheet.ciiva.com/43460/1678796-43460347.pdf?src-supplier=Farnell; ComponentLink2Description: https://datasheet.ciiva.com/43460/1678796-43460347.pdf?src-supplier=Farnell; ComponentLink3URL: https://datasheet.ciiva.com/46389/1678796-46389518.pdf?src-supplier=Element14; ComponentLink3Description: https://datasheet.ciiva.com/46389/1678796-46389518.pdf?src-supplier=Element14; ComponentLink4URL: https://datasheet.ciiva.com/5959/1678796-5959692.pdf?src-supplier=Farnell; ComponentLink4Description: https://datasheet.ciiva.com/5959/1678796-5959692.pdf?src-supplier=Farnell; ComponentLink5URL: https://datasheet.ciiva.com/28695/1678796-28695758.pdf?src-supplier=Element14; ComponentLink5Description: https://datasheet.ciiva.com/28695/1678796-28695758.pdf?src-supplier=Element14; ComponentLink6URL: https://datasheet.ciiva.com/16783/70260739-16783734.pdf?src-supplier=Allied+Electronics; ComponentLink6Description: https://datasheet.ciiva.com/16783/70260739-16783734.pdf?src-supplier=Allied+Electronics; ComponentLink7URL: https://datasheet.ciiva.com/16778/70260739-16778335.pdf?src-supplier=Allied+Electronics; ComponentLink7Description: https://datasheet.ciiva.com/16778/70260739-16778335.pdf?src-supplier=Allied+Electronics; ComponentLink8URL: https://datasheet.ciiva.com/48531/aoa0000ce1-48531077.pdf?src-supplier=Avnet; ComponentLink8Description: https://datasheet.ciiva.com/48531/aoa0000ce1-48531077.pdf?src-supplier=Avnet; ComponentLink9URL: https://datasheet.ciiva.com/30097/4aoa0000ce1-30097116.pdf?src-supplier=Onlinecomponents.com; ComponentLink9Description: https://datasheet.ciiva.com/30097/4aoa0000ce1-30097116.pdf?src-supplier=Onlinecomponents.com; Supplier Part Number 1: 667-ERJ-2GE0R00X
R3 R4 = RES_4.7K_1%_100mW_0402: Res Thick Film 0402 4.7K Ohm 1% 0.1W ±100ppm/°C Molded SMD Punched Carrier T/R; Manufacturer: Panasonic; Power Rating: 100mW; Voltage Rating: 50V; Supplier 1: Digi-Key; Manufacturer Part Number: ERJ-2RKF4701X; RoHS: Yes; Category: Chip SMD Resistors; Stock 1: 2269675; Pricing 1: 1=0.1, 10=0.024, 50=0.015, 100=0.0125, 500=0.00848, 1000=0.00731, 5000=0.00531 (USD); Case Code (Metric): 1005; Weight: 0.000388oz; Min Operating Temperature: -55°C; Max Operating Temperature: 155°C; Temperature Coefficient: 100ppm/°C; Packaging: Cut Tape; Package Quantity: 10000; Termination: SMD/SMT; Voltage Rating (DC): 50V; Series: ERJ-2Rx; Technology: THICK FILM; Length: 1mm; Width: 0.5mm; Height: 0.35mm; Lead Free: Lead Free; RoHS Compliant: Yes; ComponentLink1URL: https://datasheet.ciiva.com/30053/aoa0000ce2-30053990.pdf?src-supplier=Onlinecomponents.com; ComponentLink1Description: https://datasheet.ciiva.com/30053/aoa0000ce2-30053990.pdf?src-supplier=Onlinecomponents.com; ComponentLink2URL: https://datasheet.ciiva.com/7830/aoa0000ce2-7830727.pdf?src-supplier=Element14; ComponentLink2Description: https://datasheet.ciiva.com/7830/aoa0000ce2-7830727.pdf?src-supplier=Element14; ComponentLink3URL: https://datasheet.ciiva.com/22781/1678782-22781576.pdf?src-supplier=Farnell; ComponentLink3Description: https://datasheet.ciiva.com/22781/1678782-22781576.pdf?src-supplier=Farnell; ComponentLink4URL: https://datasheet.ciiva.com/22667/1678782-22667886.pdf?src-supplier=Element14; ComponentLink4Description: https://datasheet.ciiva.com/22667/1678782-22667886.pdf?src-supplier=Element14; ComponentLink5URL: https://datasheet.ciiva.com/22723/1678782-22723903.pdf?src-supplier=Element14; ComponentLink5Description: https://datasheet.ciiva.com/22723/1678782-22723903.pdf?src-supplier=Element14; Supplier Part Number 1: P4.70KLCT-ND
R5 R6 = RES_1.21K_1%_63mW_0402: Res Thick Film 0402 1.21K Ohm 1% 1/16W ±100ppm/°C Molded SMD Paper T/R; Manufacturer: Vishay; Max Power Dissipation: 63mW; Voltage Rating: 50V; Supplier 1: Digikey; Manufacturer Part Number: CRCW04021K21FKED; RoHS: Yes; Category: Chip SMD Resistors; Stock 1: 42081; Pricing 1: 1=0.1, 10=0.026, 50=0.0164, 100=0.0136, 500=0.00918, 1000=0.00789, 5000=0.00576 (USD); Number of Pins: 2; Case Code (Metric): 1005; Case Code (Imperial): 0402; Weight: 2.3E-05oz; Contact Plating: Tin; Size Code: 0402; Min Operating Temperature: -55°C; Max Operating Temperature: 155°C; Packaging: Tape and Reel; Number of Terminations: 2; Temperature Coefficient: 100ppm/°C; Series: CRCW; Package Quantity: 10000; Power Rating: 63mW; Termination: SMD/SMT; Features: Automotive AEC-Q200; Resistor Type: Thick Film; Voltage Rating (DC): 50V; Construction: Rectangular; Technology: THICK FILM; Resistance Tolerance: 1%; Length: 1mm; Width: 0.5mm; Height: 0.35mm; Depth: 0.5mm; Ratings: AEC-Q200; Radiation Hardening: No; RoHS Compliant: Yes; Lead Free: Lead Free; Military Standard: Not; Reach SVHC Compliant: Unknown; ComponentLink1URL: https://datasheet.ciiva.com/11818/0900766b80d98824-11818004.pdf?src-supplier=Rs; ComponentLink1Description: https://datasheet.ciiva.com/11818/0900766b80d98824-11818004.pdf?src-supplier=Rs; ComponentLink2URL: https://datasheet.ciiva.com/2463/dcrcwe3-2463712.pdf?src-supplier=Digikey; ComponentLink2Description: https://datasheet.ciiva.com/2463/dcrcwe3-2463712.pdf?src-supplier=Digikey; ComponentLink3URL: https://datasheet.ciiva.com/2463/dcrcwe3-2463713.pdf?src-supplier=Digikey; ComponentLink3Description: https://datasheet.ciiva.com/2463/dcrcwe3-2463713.pdf?src-supplier=Digikey; ComponentLink4URL: https://datasheet.ciiva.com/2463/dcrcwe3-2463714.pdf?src-supplier=Digikey; ComponentLink4Description: https://datasheet.ciiva.com/2463/dcrcwe3-2463714.pdf?src-supplier=Digikey; ComponentLink5URL: https://datasheet.ciiva.com/3256/dcrcwe3-3256158.pdf?src-supplier=Avnet; ComponentLink5Description: https://datasheet.ciiva.com/3256/dcrcwe3-3256158.pdf?src-supplier=Avnet; ComponentLink6URL: https://datasheet.ciiva.com/3256/dcrcwe3-3256159.pdf?src-supplier=Avnet; ComponentLink6Description: https://datasheet.ciiva.com/3256/dcrcwe3-3256159.pdf?src-supplier=Avnet; ComponentLink7URL: https://datasheet.ciiva.com/16436/dcrcwe3-16436188.pdf?src-supplier=Future+Electronics; ComponentLink7Description: https://datasheet.ciiva.com/16436/dcrcwe3-16436188.pdf?src-supplier=Future+Electronics; ComponentLink8URL: https://datasheet.ciiva.com/16765/70201119-16765014.pdf?src-supplier=Allied+Electronics; ComponentLink8Description: https://datasheet.ciiva.com/16765/70201119-16765014.pdf?src-supplier=Allied+Electronics; ComponentLink9URL: https://datasheet.ciiva.com/7690/1697337-7690653.pdf?src-supplier=Element14; ComponentLink9Description: https://datasheet.ciiva.com/7690/1697337-7690653.pdf?src-supplier=Element14; ComponentLink10URL: https://datasheet.ciiva.com/7690/1533075-7690846.pdf?src-supplier=Element14; ComponentLink10Description: https://datasheet.ciiva.com/7690/1533075-7690846.pdf?src-supplier=Element14; Supplier Part Number 1: 541-1.21KLCT-ND
U1 = IC_LEVEL_TRASLATOR_TCA9406DCUR: Voltage Level Translator Bidirectional 1 Circuit 2 Channel 24Mbps US8; Manufacturer: Texas Instruments; Propagation Delay: 260ns; Min Supply Voltage: 1.65V; Max Supply Voltage: 5.5V; Number of Outputs: 2; High Level Output Current: -50mA; Low Level Output Current: 50mA; Number of Circuits: 1; Supplier 1: Mouser; Manufacturer Part Number: TCA9406DCUR; RoHS: Yes; Category: Voltage Level Shifters; Stock 1: 11492; Pricing 1: 1=0.84, 10=0.536, 50=0.536, 100=0.439, 500=0.419, 1000=0.396, 3000=0.387, 6000=0.378, 9000=0.372, 10000=0.372, 24000=0.357 (USD); Case/Package: VSSOP; Number of Pins: 8; Weight: 0.00067oz; Min Operating Temperature: -40°C; Max Operating Temperature: 85°C; Package Quantity: 3000; Data Rate: 24Mbps; Packaging: Tape and Reel; Logic Function: Translator; Series: TCA; Channel Type: Bidirectional; Length: 2.1mm; Width: 2.4mm; Height: 0.8mm; Radiation Hardening: No; Reach SVHC Compliant: No; Lead Free: Lead Free; RoHS Compliant: Yes; ComponentLink1URL: https://datasheet.ciiva.com/1899/tca9406-1899424.pdf?src-supplier=Digikey; ComponentLink1Description: https://datasheet.ciiva.com/1899/tca9406-1899424.pdf?src-supplier=Digikey; ComponentLink2URL: https://datasheet.ciiva.com/3149/tca9406-3149521.pdf?src-supplier=Avnet; ComponentLink2Description: https://datasheet.ciiva.com/3149/tca9406-3149521.pdf?src-supplier=Avnet; ComponentLink3URL: https://datasheet.ciiva.com/15134/getdatasheetpartid-312405-15134730.pdf?src-supplier=Verical; ComponentLink3Description: https://datasheet.ciiva.com/15134/getdatasheetpartid-312405-15134730.pdf?src-supplier=Verical; ComponentLink4URL: https://datasheet.ciiva.com/1899/tca9406-1899423.pdf?src-supplier=Digikey; ComponentLink4Description: https://datasheet.ciiva.com/1899/tca9406-1899423.pdf?src-supplier=Digikey; ComponentLink5URL: https://datasheet.ciiva.com/1899/tca9406-1899425.pdf?src-supplier=Digikey; ComponentLink5Description: https://datasheet.ciiva.com/1899/tca9406-1899425.pdf?src-supplier=Digikey; ComponentLink6URL: https://datasheet.ciiva.com/1503/1882429-1503921.pdf?src-supplier=Element14; ComponentLink6Description: https://datasheet.ciiva.com/1503/1882429-1503921.pdf?src-supplier=Element14; ComponentLink7URL: https://datasheet.ciiva.com/46391/1817453-46391351.pdf?src-supplier=Element14; ComponentLink7Description: https://datasheet.ciiva.com/46391/1817453-46391351.pdf?src-supplier=Element14; Supplier Part Number 1: 595-TCA9406DCUR